# Altium schematic sheet USB.SchDoc
size 304 x 190 mm; SheetNumber: 4; SheetTotal: 4
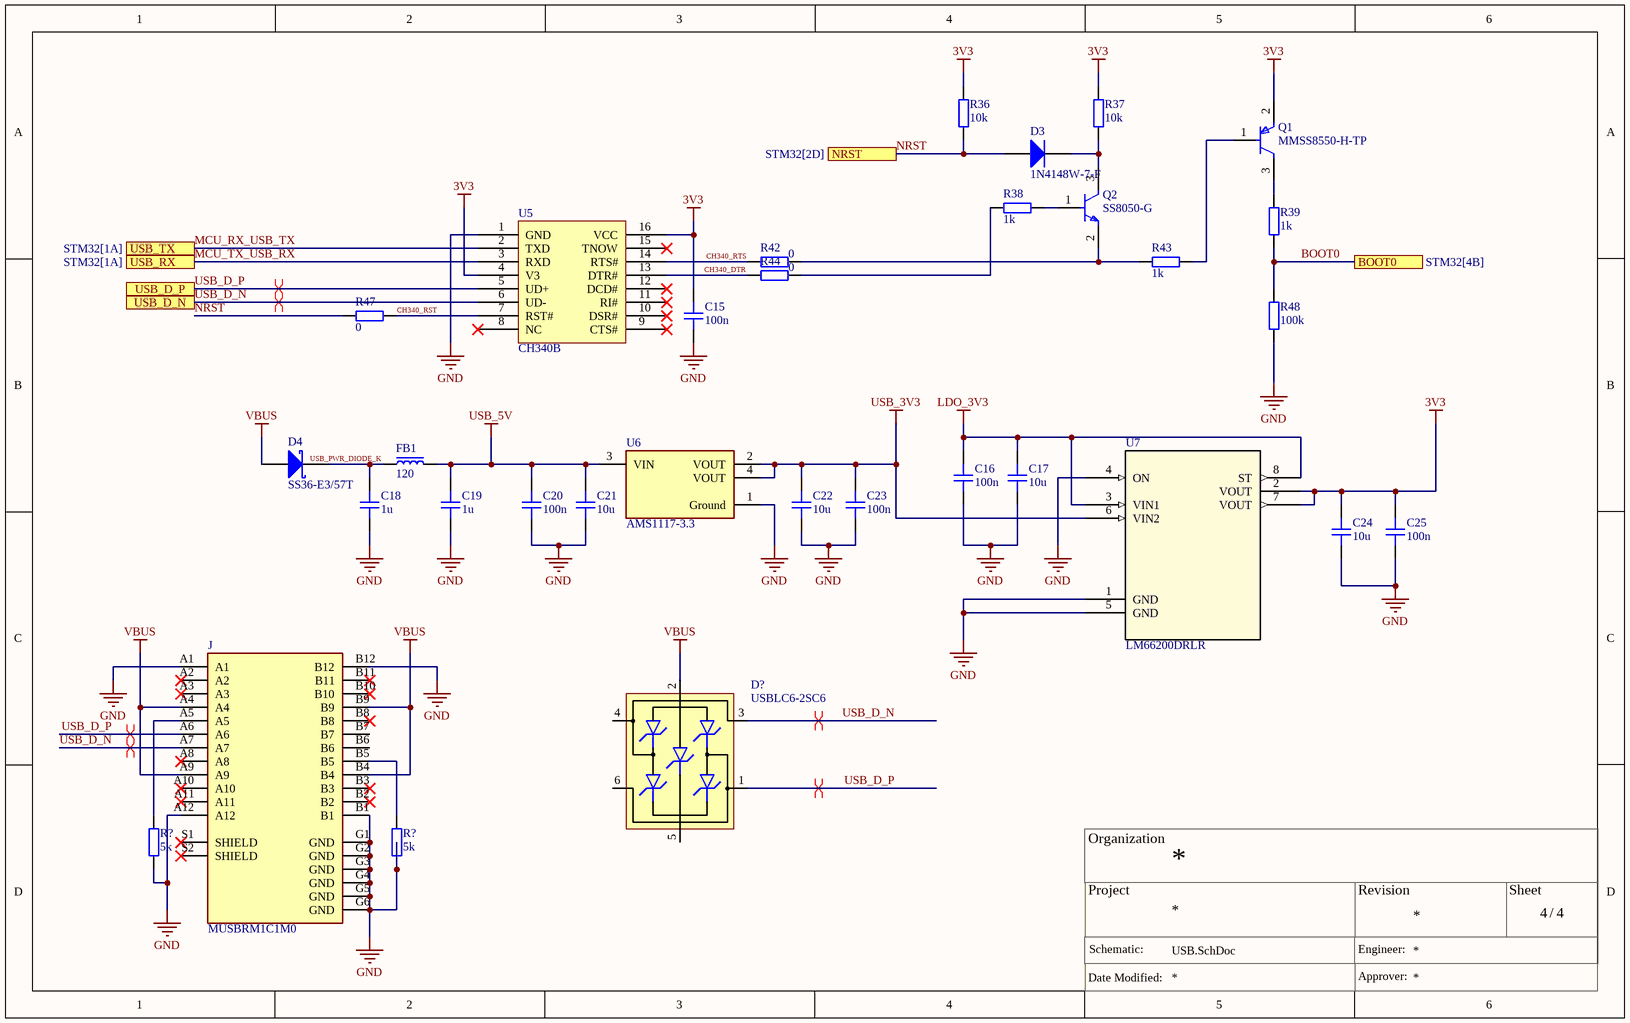
[diagram p0: USB.SchDoc]

## Parts
(Parts that share a designator on the sheet are numbered #1, #2 ... from top to bottom, then left to right.)
C15  100n  [CAP_0402]
C16  100n  [CAP_0402]
C17  10u  [CAP_0402]
C18  1u  [CAP_0402]
C19  1u  [CAP_0402]
C20  100n  [CAP_0402]
C21  10u  [CAP_0402]
C22  10u  [CAP_0402]
C23  100n  [CAP_0402]
C24  10u  [CAP_0402]
C25  100n  [CAP_0402]
D3  1N4148W-7-F  [DIOD-SOD123-2_V]
D4  SS36-E3/57T  [VISH-DO-214AB-2_V]
D?  USBLC6-2SC6  [SOT-23-6]
FB1  120  [FB_0603]
J  MUSBRM1C1M0  [AMPHENOL_MUSBRM1C1M0]
Q1  MMSS8550-H-TP  [FP-SOT-23-IPC_B]
Q2  SS8050-G  [FP-SS8050-G-MFG]
R36  10k  [RES_0402]
R37  10k  [RES_0402]
R38  1k  [RES_0402]
R39  1k  [RES_0402]
R42  0  [RES_0402]
R43  1k  [RES_0402]
R44  0  [RES_0402]
R47  0  [RES_0402]
R48  100k  [RES_0402]
R?#1  5k  [RES_0402]
R?#2  5k  [RES_0402]
U5  CH340B  [CH340B]
U6  AMS1117-3.3  [FP-AMS1117-IPC_C]
U7  LM66200DRLR  [SOT-5X3_DRL_TEX]

## Ports
BOOT0 (see STM32[4B]), NRST (see STM32[2D]), USB_D_N, USB_D_P, USB_RX (see STM32[1A]), USB_TX (see STM32[1A])

## Nets
3V3: C15.2 C24.2 C25.2 Q1.2(E) R36.2 R37.2 U5.4(V3) U5.16(VCC) U7.2(VOUT) U7.7(VOUT)
GND: C15.1 C16.1 C17.1 C18.1 C19.1 C20.1 C21.1 C22.1 C23.1 C24.1 C25.1 J.A1 J.A12 J.B1 J.B12 J.G1(GND) J.G2(GND) J.G3(GND) J.G4(GND) J.G5(GND) J.G6(GND) R48.1 R?#1.1 R?#2.1 U5.1(GND) U6.1(Ground) U7.1(GND) U7.4(ON) U7.5(GND)
LDO_3V3: C16.2 C17.2 U7.3(VIN1) U7.8(ST)
USB_3V3: C22.2 C23.2 U6.2(VOUT) U6.4(VOUT) U7.6(VIN2)
USB_5V: C19.2 C20.2 C21.2 FB1.2 U6.3(VIN)
VBUS: D4.1(A) D?.2(GND) J.A4 J.A9 J.B4 J.B9
BOOT0: R39.1 R48.2 ; port BOOT0
CH340_DTR: R44.1 U5.13(DTR#)
CH340_RST: R47.2 U5.7(RST#)
CH340_RTS: R42.1 U5.14(RTS#)
MCU_RX_USB_TX: U5.2(TXD) ; port USB_TX
MCU_TX_USB_RX: U5.3(RXD) ; port USB_RX
NRST: D3.1(A) R36.1 R47.1 ; port NRST
USB_D_N: D?.3(IO2) J.A7 U5.6(UD-) ; port USB_D_N
USB_D_P: D?.1(IO1) J.A6 U5.5(UD+) ; port USB_D_P
USB_PWR_DIODE_K: C18.2 D4.2(K) FB1.1
NetD3_2: D3.2(K) Q2.3(C) R37.1
NetJ_A5: J.A5 R?#1.2
NetJ_B5: J.B5 R?#2.2
NetQ1_1: Q1.1(B) R43.2
NetQ1_3: Q1.3(C) R39.2
NetQ2_1: Q2.1(B) R38.2
NetQ2_2: Q2.2(E) R42.2 R43.1
NetR38_1: R38.1 R44.2

Not connected (* = marked no-connect by the designer): D? 4(IO2) 5(VBUS) 6(IO1); J A2* A3* A8* A10* A11* B2* B3* B6 B7 B8* B10* B11* S1(SHIELD)* S2(SHIELD)*; U5 8(NC)* 9(CTS#)* 10(DSR#)* 11(RI#)* 12(DCD#)* 15(TNOW)*

## Layout directives
differential pair: USB_D_N, USB_D_P

## Notes on the sheet
- Organization
- Project
- Revision
- Sheet
- Schematic:
- Engineer:
- /
- Date Modified:
- Approver:

## Library data of the parts
C15-C25 = CAP_0402: Capacitor SMD 0402; Manufacturer: *; Manufacturer Part Number: *; Distributor Link: *; Rating: *; Dielectric: *
  C15 C16 C20 C23 C25: LCSC Part #: C307331
  C17 C21 C22 C24: LCSC Part #: C15525
  C18 C19: LCSC Part #: C52923
D3 = CMP-2000-04932-2: Fast Switching Diode, 100 V, 0.15 A, -65 to 150 degC, 2-Pin?SOD123, RoHS, Tape and Reel; Recovery Time: 4ns; Brand: DiodesIncorporated; Unit Weight: 0.000353oz; Max Surge Current: 2A; Peak Reverse Voltage: 100V; Ir - Reverse Current: 1uA; Vf - Forward Voltage: 1.25V; Configuration: Single; If - Forward Current: 0.15A; Product Category: Diodes-GeneralPurpose,Power,Switching; Operating Temperature Range: -65Cto+150C; Packaging: Reel; Manufacturer URL: http://www.diodes.com/; Maximum Operating Temperature: +150C; Height: 1.25mm; Minimum Operating Temperature: -65C; Product: SwitchingDiodes; Package URL: http://www.diodes.com/datasheets/ds18004.pdf; Type: SwitchingDiode; Package Reference: SOD123-2; Width: 1.7mm; Datasheet URL: http://www.farnell.com/datasheets/1915529.pdf; Datasheet Version: Rev. 24-2, 10/2013; Series: 1N4148; Factory Pack Quantity: 3000; Length: 2.85mm; RoHS: True; Manufacturer: DiodesIncorporated; Mounting Style: SMD/SMT; Package / Case: SOD-123; LCSC Part #: C83528
D4 = CMP-2000-07150-1: Surface Mount Schottky Barrier Rectifier, 60 V, 3 A, -55 to 150 degC, 2-Pin SMC (DO-214AB), RoHS, Tape and Reel; Manufacturer: Vishay; Forward Current If(AV): 3A; Diode Configuration: Single; Forward Surge Current Ifsm Max: 100A; SVHC: ToBeAdvised; No. of Pins: 2Pins; Forward Voltage VF Max: 750mV; Repetitive Reverse Voltage Vrrm Max: 60V; Datasheet URL: http://www.vishay.com/docs/88751/ss32.pdf; Datasheet Version: 08/2015; Manufacturer URL: http://www.vishay.com/; Diode Type: Schottky; Package Reference: DO-214AB; Mounting Technology: SurfaceMount; Diode Case Style: DO-214AB; Package Description: 2-Pin Surface Mount Device, Body 6.855 x 5.905 mm; Packaging: CutTape; Operating Temperature Max: 150°C; Product Range: -; LCSC Part #: C35722
D? = USBLC6-2SC6: Low-Capacitance ESD Protection USB; Manufacturer: STMicroelectronics; Manufacturer Part Number: USBLC6-2SC6; Distributor Link: https://www.mouser.de/ProductDetail/STMicroelectronics/USBLC6-2SC6?qs=po45yt2pPpu%2FhNIlwQdTlg%3D%3D
FB1 = FB_0603: Ferrite Bead SMD 0603; Manufacturer: *; Manufacturer Part Number: *; Distributor Link: *; LCSC Part #: C2661432
J = MUSBRM1C1M0: USB-C _USB TYPE-C_ Receptacle Connector 24 Position Panel Mount, Through Hole, Right Angle; MF: Amphenol ICC; SnapEDA_Link: https://www.snapeda.com/parts/MUSBRM1C1M0/Amphenol%20FCI/view-part/3662036/?ref=snap; MP: MUSBRM1C1M0; Price: None; Value: *; Availability: Unavailable; Package: None
Q1 = CMP-56214-000002-1: TRANS PNP 25V 1.5A SOT23; Emitter Base Voltage (VEBO): 1.6V; Collector Base Voltage (VCBO): 40V; Collector Emitter Saturation Voltage: 500mV; Max Power Dissipation: 625mW; Transition Frequency: 100MHz; Element Configuration: Single; hFE Min: 40; Polarity: PNP; Lead Free: Lead Free; Max Breakdown Voltage: 25V; Package Quantity: 1; Min Operating Temperature: -55°C; Case/Package: SOT-23; Max Collector Current: 1.5A; Mount: Surface Mount; Packaging: Tape and Reel; Collector Emitter Voltage (VCEO): 500mV; Max Operating Temperature: 150°C; Gain Bandwidth Product: 100MHz; Collector Emitter Breakdown Voltage: 25V; LCSC Part #: C8542
Q2 = CMP-20235-000001-1: NPN TRANSISTOR 1.5A 40V SOT-23 R; Transition Frequency: 100MHz; Max Breakdown Voltage: 25V; Collector Emitter Voltage (VCEO): 400mV; Max Power Dissipation: 300mW; Max Collector Current: 1.5A; Case/Package: TO-236-3; Packaging: Tape and Reel; RoHS Compliant: Yes; Mount: Surface Mount; Collector Emitter Breakdown Voltage: 25V; LCSC Part #: C2150
R36-R39 R42-R44 R47 R48 R?#1 R?#2 = RES_0402: Resistor SMD 0402; Manufacturer: *; Manufacturer Part Number: *; Distributor Link: *
  R36: LCSC part #: C25744
  R37: LCSC Part #: C25744
  R38 R39 R43: LCSC Part #: C11702
  R42 R44 R47: LCSC Part #: C17168
  R48: LCSC Part #: C25741
  R?#1 R?#2: LCSC Part #: C25900
U6 = CMP-209535-000001-1: LDO Voltage Regulators 1A, 3.3V; Manufacturer: Advanced Monolithic Systems; Dropout Voltage: 1.1V; Output Type: Fixed; Nominal Supply Current: 5mA; Max Power Dissipation: 1.2W; Max Supply Voltage: 15V; Number Of Outputs: 1; Standoff Height: 0.64mm; Max Junction Temp: +125°C; Height: 1.8mm; Package: AMS1117; Device Class L2: Power Management ICs; ComponentLink2Description: Datasheet; ComponentLink2URL: http://www.advanced-monolithic.com/pdf/ds1117.pdf; Category: IC; RoHS: TRUE; Automotive: No; Device Class L1: Integrated Circuits (ICs); Output Current: 1A; Device Class L3: Voltage Regulators - Linear; Temperature: -40°C to +125°C; Output Voltage: 3.3V; Manufacturer Part Number: AMS1117-3.3; Temperature Range Low: -40°C; Octopart: https://octopart.com/ams1117-3.3-advanced+monolithic+systems-25899300; Lead Free: Yes; Ipc Land Pattern Name: SOT229P700X180-4; Temperature Range High: +125°C; LCSC Part #: C6186
U7 = LM66200DRLR: No Description Available; Mfr_Name: Texas Instruments; Copyright: Copyright (C) 2023 Ultra Librarian. All rights reserved.; Manufacturer_Part_Number: LM66200DRLR; RefDes: RefDes; Type: DEV; LCSC Part #: C3235556
U5 = CH340B: LCSC Part #: C81010